# Altium schematic sheet 婴儿监测系统.SchDoc
size A3
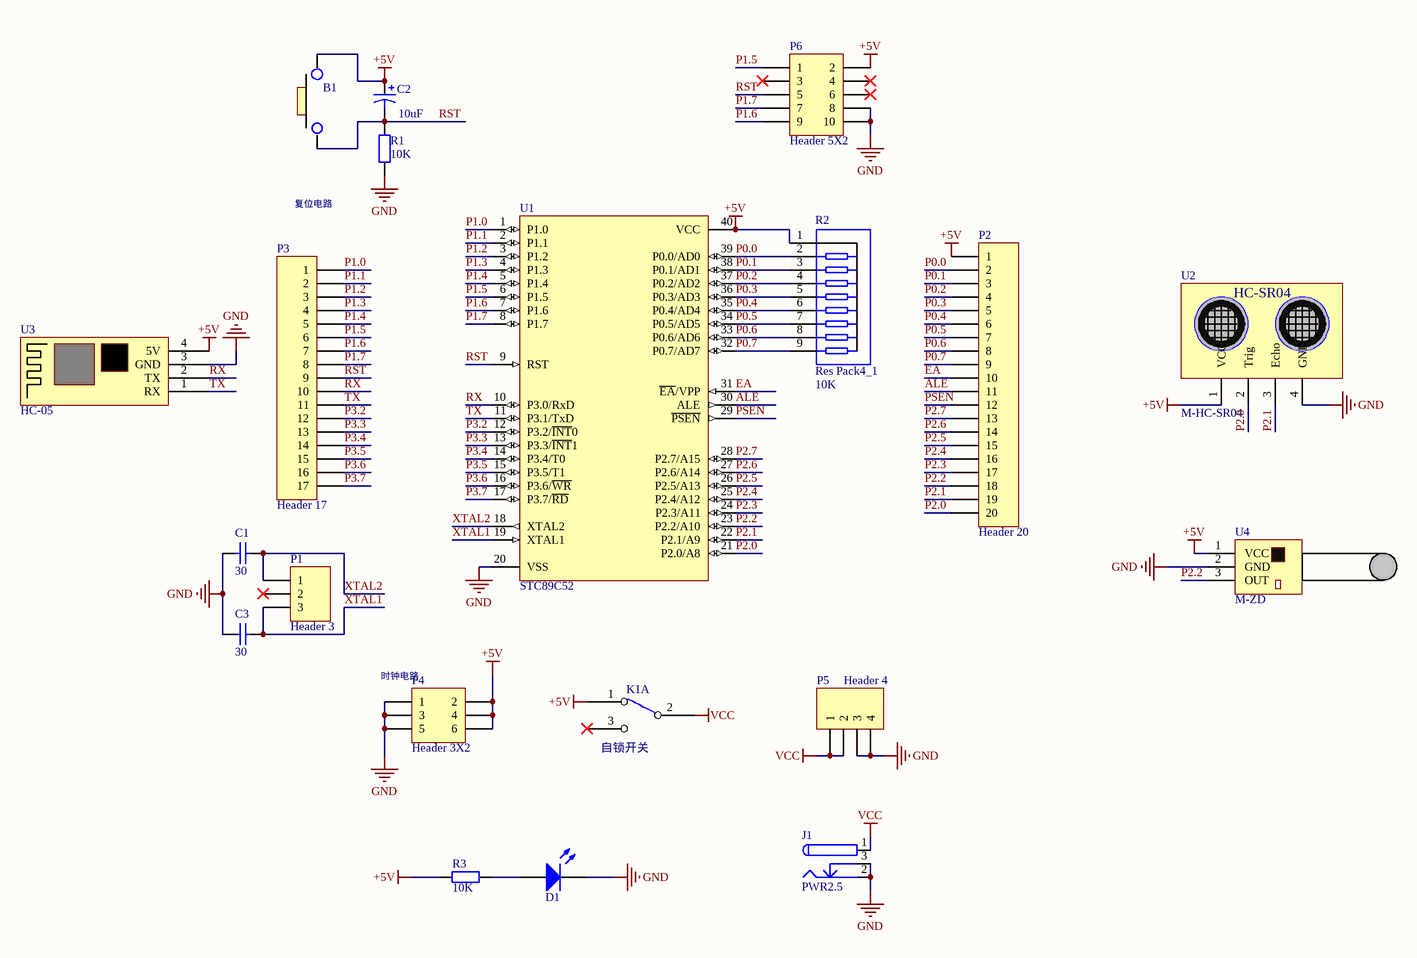
[diagram p0: 婴儿监测系统.SchDoc]

## Parts
B1  Button  [BUTTON]  (value not drawn)
C1  value 30  [C-RAD]  (hidden comment: Cap)
C2  10uF  [C-RB-5.0]
C3  value 30  [C-RAD]  (hidden comment: Cap)
D1  LED0  [LED_A2]  (value not drawn)
J1  PWR2.5  [kld-DC(2.5)]
K1  自锁开关  [SW-TH_6PIN-L5.80-W5.80-BL]  (part A of 2)
P1  Header 3  [HDR1X3]
P2  Header 20  [HDR1X20]
P3  Header 17  [HDR1X17]
P4  Header 3X2  [HDR2X3]
P5  Header 4  [HDR1X4]
P6  Header 5X2  [HDR2X5]
R1  value 10K  [AXIAL-0.3]  (hidden comment: Res1)
R2  Res Pack4_1  value 10K  [HDR1X9]
R3  value 10K  [AXIAL-0.3]  (hidden comment: Res1)
U1  STC89C52  [DIP-40 (fan)]
U2  M-HC-SR04  [M-HC-SR04]
U3  HC-05  [HC-04]
U4  M-ZD  [M-ZD]

## Nets
+5V: B1.2 C2.1 K1.1 P2.1 P4.2 P4.4 P4.6 P6.2 R2.1 R3.1 U1.40(VCC) U2.1(VCC) U3.4(5V) U4.1(VCC)
GND: C1.1 C3.1 D1.2(K) J1.2 J1.3 P4.1 P4.3 P4.5 P5.3 P5.4 P6.8 P6.10 R1.1 U1.20(VSS) U2.4(GND) U3.3(GND) U4.2(GND)
VCC: J1.1 K1.2 P5.1 P5.2
ALE: P2.11 U1.30(ALE)
EA: P2.10 U1.31(~{EA}/VPP)
P0.0: P2.2 R2.2 U1.39(P0.0/AD0)
P0.1: P2.3 R2.3 U1.38(P0.1/AD1)
P0.2: P2.4 R2.4 U1.37(P0.2/AD2)
P0.3: P2.5 R2.5 U1.36(P0.3/AD3)
P0.4: P2.6 R2.6 U1.35(P0.4/AD4)
P0.5: P2.7 R2.7 U1.34(P0.5/AD5)
P0.6: P2.8 R2.8 U1.33(P0.6/AD6)
P0.7: P2.9 R2.9 U1.32(P0.7/AD7)
P1.0: P3.1 U1.1(P1.0)
P1.1: P3.2 U1.2(P1.1)
P1.2: P3.3 U1.3(P1.2)
P1.3: P3.4 U1.4(P1.3)
P1.4: P3.5 U1.5(P1.4)
P1.5: P3.6 P6.1 U1.6(P1.5)
P1.6: P3.7 P6.9 U1.7(P1.6)
P1.7: P3.8 P6.7 U1.8(P1.7)
P2.0: P2.20 U1.21(P2.0/A8) U2.2(Trig)
P2.1: P2.19 U1.22(P2.1/A9) U2.3(Echo)
P2.2: P2.18 U1.23(P2.2/A10) U4.3(OUT)
P2.3: P2.17 U1.24(P2.3/A11)
P2.4: P2.16 U1.25(P2.4/A12)
P2.5: P2.15 U1.26(P2.5/A13)
P2.6: P2.14 U1.27(P2.6/A14)
P2.7: P2.13 U1.28(P2.7/A15)
P3.2: P3.12 U1.12(P3.2/~{INT}0)
P3.3: P3.13 U1.13(P3.3/~{INT}1)
P3.4: P3.14 U1.14(P3.4/T0)
P3.5: P3.15 U1.15(P3.5/T1)
P3.6: P3.16 U1.16(P3.6/~{WR})
P3.7: P3.17 U1.17(P3.7/~{RD})
PSEN: P2.12 U1.29(~{PSEN})
RST: B1.1 C2.2 P3.9 P6.5 R1.2 U1.9(RST)
RX: P3.10 U1.10(P3.0/RxD) U3.2(TX)
TX: P3.11 U1.11(P3.1/TxD) U3.1(RX)
XTAL1: C3.2 P1.3 U1.19(XTAL1)
XTAL2: C1.2 P1.1 U1.18(XTAL2)
NetD1_1: D1.1(A) R3.2

Not connected (* = marked no-connect by the designer): K1 3*; P1 2*; P6 3* 4* 6*

## Notes on the sheet
- 复位电路
- (near P4) 时钟电路
- (in symbol M-HC-SR04) HC-SR04

## Library data of the parts
C1 C3 = Cap: 无极性电容; Published: 8-Jun-2000; LatestRevisionDate: 17-Jul-2002; LatestRevisionNote: Re-released for DXP Platform.; PackageReference: RAD-0.3; Publisher: Altium Limited
C2 = Cap Pol2: 有极性插件电容; 模块属性: 公共模块; 贴插属性: C; parameter: 10uF
D1 = LED0: 发光二极管; Published: 8-Jun-2000; LatestRevisionDate: 08-Jul-2005; LatestRevisionNote: Mech Layer 1 removed.; PackageReference: LED-0; Publisher: Altium Limited
J1 = PWR2.5: Low Voltage Power Supply Connector; Published: 17-Dec-2003; DatasheetDocument: 09-May-2002; Publisher: Altium Limited; ComponentLink1Description: Manufacturer Link; ComponentLink1URL: http://domino.kycon.com/internet/Products.html
K1 = 双档拨动开关
P1 = Header 3: Header, 3-Pin; LatestRevisionDate: 17-Jul-2002; LatestRevisionNote: Re-released for DXP Platform.; Publisher: Altium Limited
P2 = Header 20: Header, 20-Pin; LatestRevisionDate: 17-Jul-2002; LatestRevisionNote: Re-released for DXP Platform.; Publisher: Altium Limited
P3 = Header 17: Header, 17-Pin; LatestRevisionDate: 17-Jul-2002; LatestRevisionNote: Re-released for DXP Platform.; Publisher: Altium Limited
P4 = Header 3X2: Header, 3-Pin, Dual row; LatestRevisionDate: 17-Jul-2002; LatestRevisionNote: Re-released for DXP Platform.; Publisher: Altium Limited
P5 = Header 4: Header, 4-Pin; LatestRevisionDate: 17-Jul-2002; LatestRevisionNote: Re-released for DXP Platform.; Publisher: Altium Limited
P6 = Header 5X2: Header, 5-Pin, Dual row; LatestRevisionDate: 17-Jul-2002; LatestRevisionNote: Re-released for DXP Platform.; Publisher: Altium Limited
R1 R3 = Res1: 贴片电阻; Published: 8-Jun-2000; LatestRevisionDate: 17-Jul-2002; LatestRevisionNote: Re-released for DXP Platform.; PackageReference: AXIAL-0.4; Publisher: Altium Limited
R2 = Res Pack4_1: Isolated Resistor Network; Published: 24-Mar-1999; LatestRevisionDate: 29-May-2009; LatestRevisionNote: IPC-7351 Footprint Added.; PackageVersion: Oct-2003; PackageReference: SSOP16; Publisher: Altium Limited; PackageDescription: 16-Pin Plastic Small Outline Package 0.65 mm Pitch; Code_JEDEC: MO-150-AC; Code_IPC: SOP65P780-16
U1 = STC89C52: 51系列单片机; Published: 21-May-2003; DatasheetVersion: 5-Jun-2002; PackageVersion: Aug-2000; PackageReference: SOT129-1; Publisher: Altium Limited; PackageDescription: DIP, Plastic; 40 Leads; Row Spacing 15.24 mm; Pitch 2.54 mm; Code_JEDEC: MO-015; ComponentLink1Description: Manufacturer Link; ComponentLink1URL: http://www-us2.semiconductors.philips.com/; ComponentLink2Description: Datasheet; ComponentLink2URL: http://www.semiconductors.philips.com/acrobat/datasheets/P89C5XX2_2.pdf
U2 = M-HC-SR04: 超声波模块
U3 = HC-05: 蓝牙模块
U4 = M-zhendong: MIC声音模块